# EAGLE design untitled (EAGLE 8.4.2)
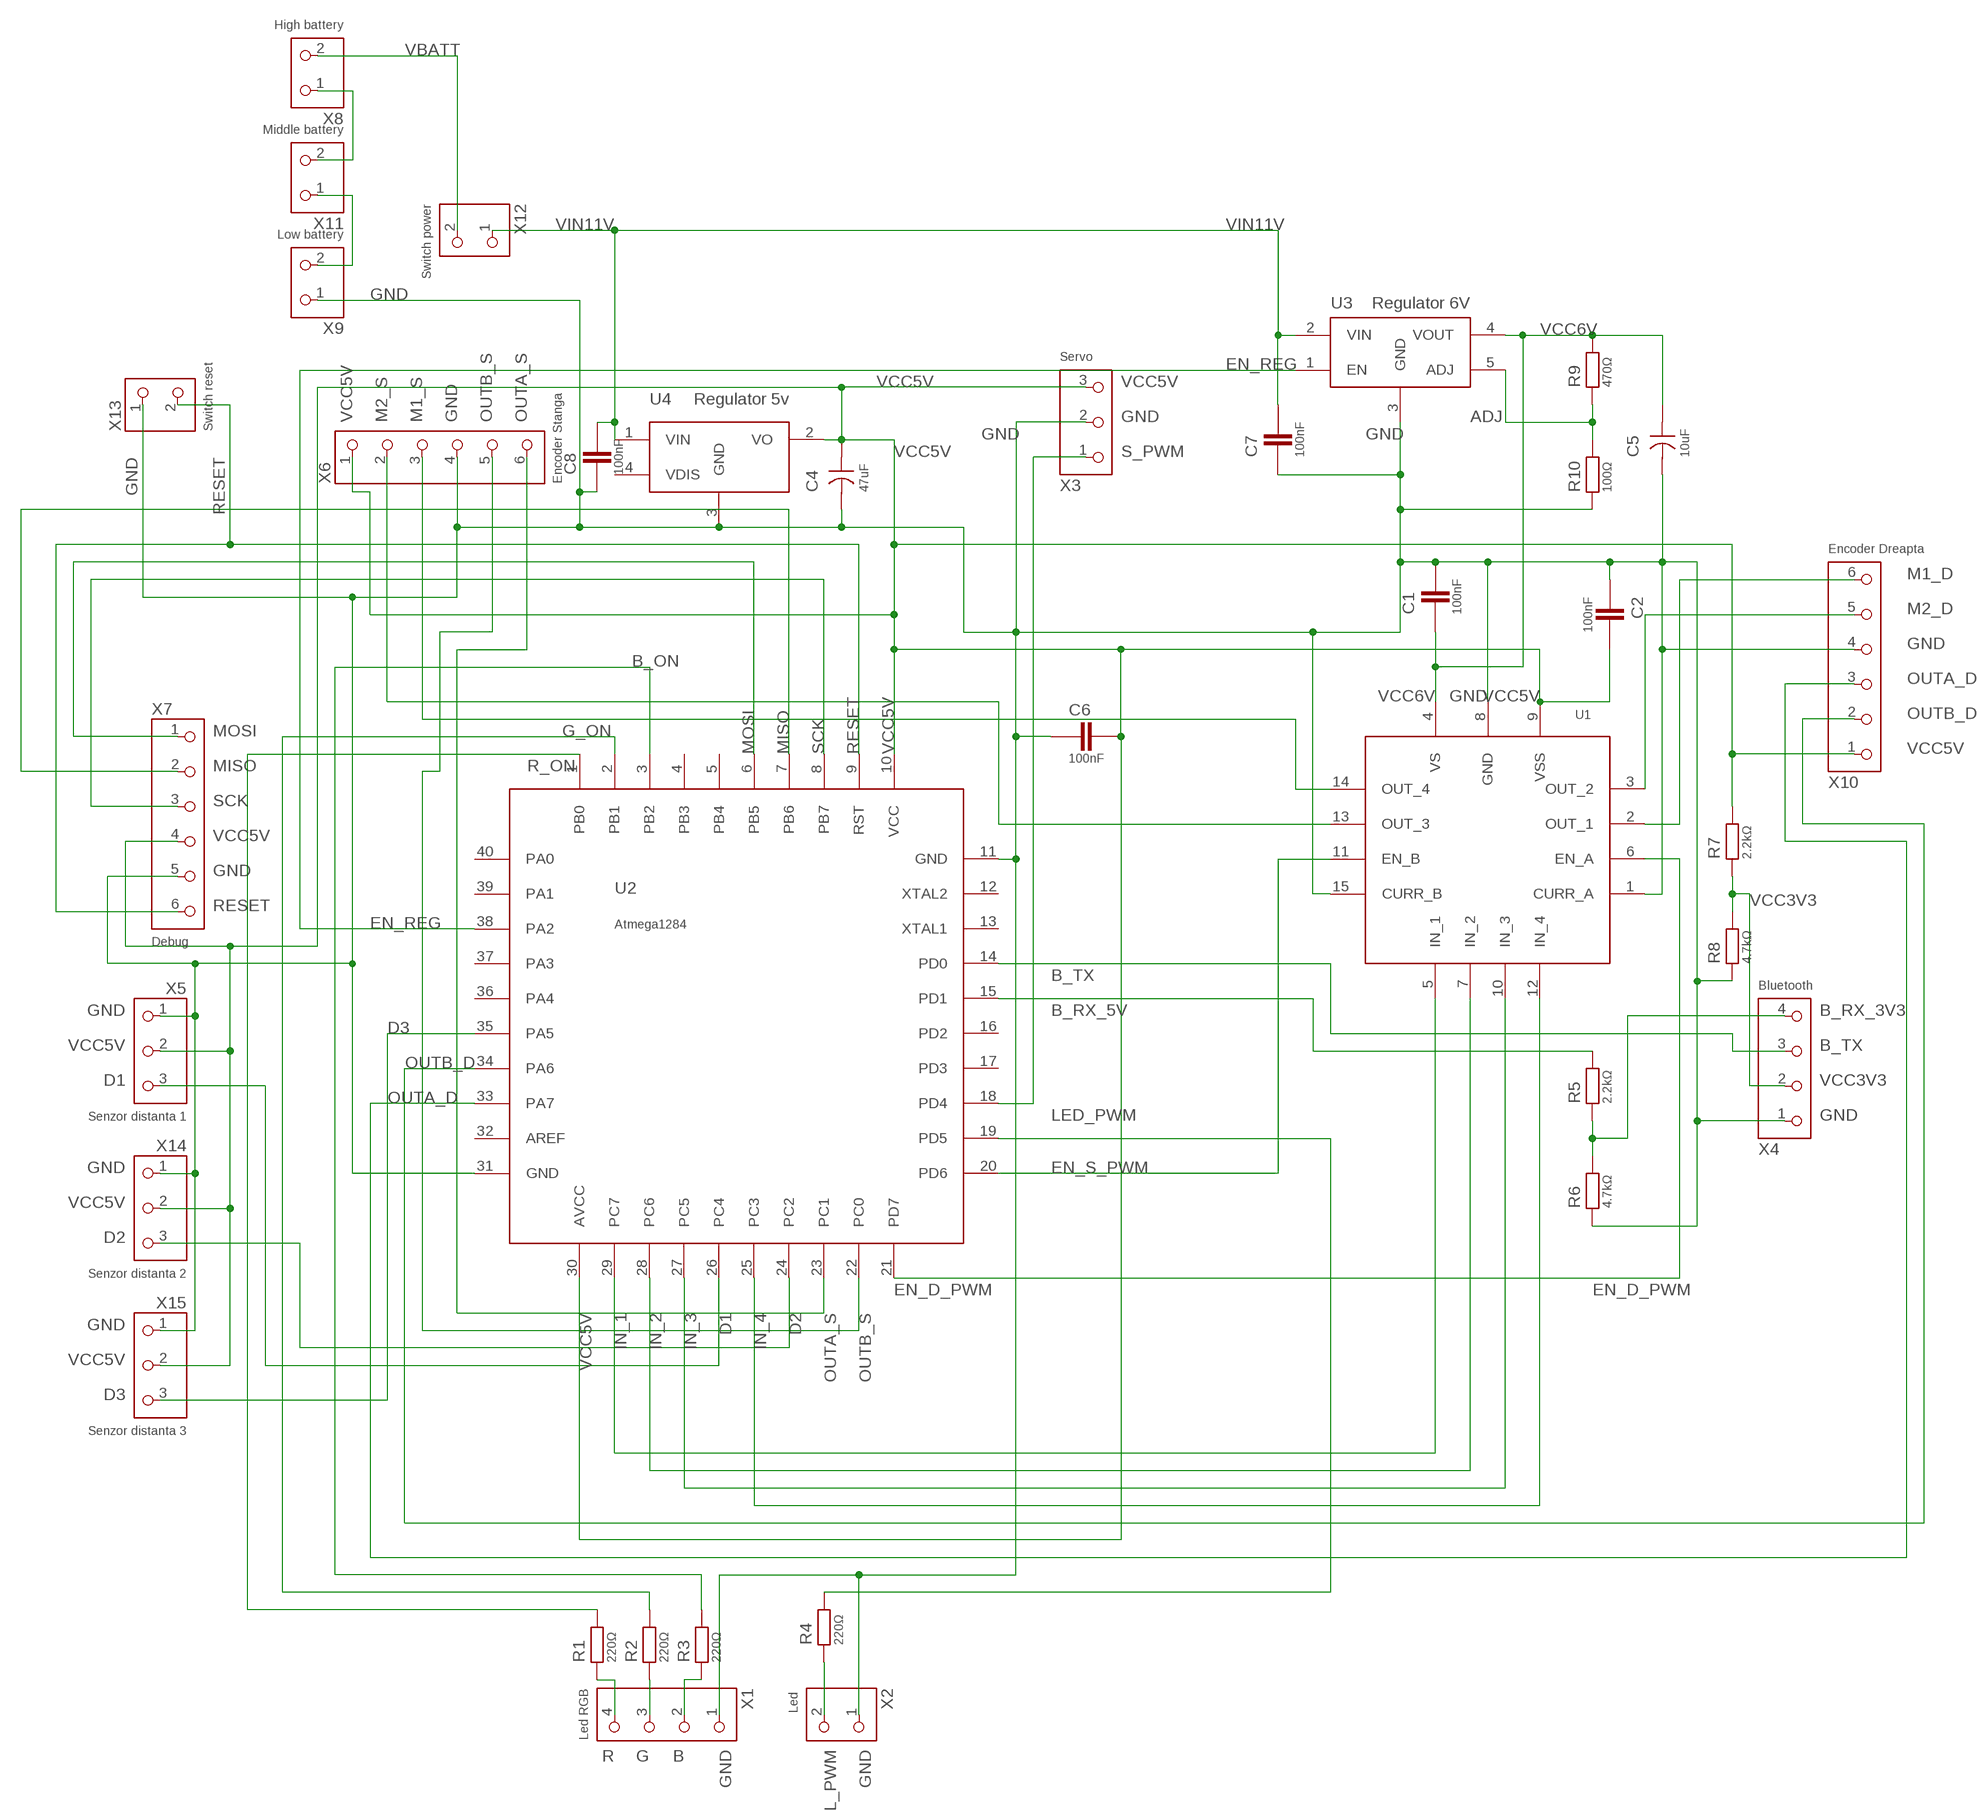
[diagram p0: schematic, sheet 1]

## Parts
C1  100nF  CAPACITORTHT_2.54  [THT_2.54]
C2  100nF  CAPACITORTHT_2.54  [THT_2.54]
C4  47uF  ELECTROLYTIC_CAPACITOR5MM_PERFBOARD  [ELECTROLYTIC_5MM_PEFRBOARD]
C5  10uF  ELECTROLYTIC_CAPACITOR5MM_PERFBOARD  [ELECTROLYTIC_5MM_PEFRBOARD]
C6  100nF  CAPACITORTHT_2.54  [THT_2.54]
C7  100nF  CAPACITORTHT_2.54  [THT_2.54]
C8  100nF  CAPACITORTHT_2.54  [THT_2.54]
R1  220Ω  RESISTORTHT_5.08  [THT_5.08]
R2  220Ω  RESISTORTHT_5.08  [THT_5.08]
R3  220Ω  RESISTORTHT_5.08  [THT_5.08]
R4  220Ω  RESISTORTHT_5.08  [THT_5.08]
R5  2.2kΩ  RESISTORTHT_2.54  [THT_2.54]
R6  4.7kΩ  RESISTORTHT_5.08  [THT_5.08]
R7  2.2kΩ  RESISTORTHT_5.08  [THT_5.08]
R8  4.7kΩ  RESISTORTHT_5.08  [THT_5.08]
R9  470Ω  RESISTORTHT_2.54  [THT_2.54]
R10  100Ω  RESISTORTHT_5.08  [THT_5.08]
U1  L298NMULTIWATT15V_PERFBOARD  [MULTIWATT15V_PERFBOARD]
U2  Atmega1284  ATMEGAPDIP  [DIP-40]
U3  Regulator 6V  MIC29XXPERFBOARD  [TO-220-5_PERFBOARD]
U4  Regulator 5v  KA78R05C  [TO-220-4]
X1  Led RGB  CONNECTOR_4PIN  [MALE_PIN_1X4]
X2  Led  CONNECTOR_2PINMALE_PIN  [MALE_PIN_1X2]
X3  Servo  CONNECTOR_3PIN  [MALE_PIN_1X3]
X4  Bluetooth  CONNECTOR_4PIN  [MALE_PIN_1X4]
X5  Senzor distanta 1  CONNECTOR_3PIN  [MALE_PIN_1X3]
X6  Encoder Stanga  CONNECTOR_6PIN2X3  [MALE_PIN_2X3]
X7  Debug  CONNECTOR_6PIN2X3  [MALE_PIN_2X3]
X8  High battery  CONNECTOR_2PINFEMALE_SCREW  [FEMALE_SCREW_1X2]
X9  Low battery  CONNECTOR_2PINFEMALE_SCREW  [FEMALE_SCREW_1X2]
X10  Encoder Dreapta  CONNECTOR_6PIN2X3  [MALE_PIN_2X3]
X11  Middle battery  CONNECTOR_2PINFEMALE_SCREW  [FEMALE_SCREW_1X2]
X12  Switch power  CONNECTOR_2PINMALE_PIN  [MALE_PIN_1X2]
X13  Switch reset  CONNECTOR_2PINMALE_PIN  [MALE_PIN_1X2]
X14  Senzor distanta 2  CONNECTOR_3PIN  [MALE_PIN_1X3]
X15  Senzor distanta 3  CONNECTOR_3PIN  [MALE_PIN_1X3]

## Nets
ADJ: R9.1 R10.2 U3.5(ADJ)
B: R3.1 X1.2
B_ON: R3.2 U2.3(PB2)
B_RX_3V3: R5.1 R6.2 X4.4
B_RX_5V: R5.2 U2.15(PD1)
B_TX: U2.14(PD0) X4.3
D1: U2.26(PC4) X5.3
D2: U2.24(PC2) X14.3
D3: U2.35(PA5) X15.3
EN_D_PWM: U1.6(EN_A) U2.21(PD7)
EN_REG: U2.38(PA2) U3.1(EN)
EN_S_PWM: U1.11(EN_B) U2.20(PD6)
G: R2.1 X1.3
G_ON: R2.2 U2.2(PB1)
GND: C1.2 C2.1 C4.- C5.- C6.1 C7.1 C8.1 R6.1 R8.1 R10.1 U1.1(CURR_A) U1.8(GND) U1.15(CURR_B) U2.11(GND) U2.31(GND) U3.3(GND) U4.3(GND) X1.1 X2.1 X3.2 X4.1 X5.1 X6.4 X7.5 X9.1 X10.4 X13.1 X14.1 X15.1
IN_1: U1.5(IN_1) U2.29(PC7)
IN_2: U1.7(IN_2) U2.28(PC6)
IN_3: U1.10(IN_3) U2.27(PC5)
IN_4: U1.12(IN_4) U2.25(PC3)
L_PWM: R4.1 X2.2
LED_PWM: R4.2 U2.19(PD5)
M1_D: U1.2(OUT_1) X10.6
M1_S: U1.14(OUT_4) X6.3
M2_D: U1.3(OUT_2) X10.5
M2_S: U1.13(OUT_3) X6.2
MISO: U2.7(PB6) X7.2
MOSI: U2.6(PB5) X7.1
N$2: X8.1 X11.2
N$43: X9.2 X11.1
OUTA_D: U2.33(PA7) X10.3
OUTA_S: U2.23(PC1) X6.6
OUTB_D: U2.34(PA6) X10.2
OUTB_S: U2.22(PC0) X6.5
R: R1.1 X1.4
R_ON: R1.2 U2.1(PB0)
RESET: U2.9(RST) X7.6 X13.2
S_PWM: U2.18(PD4) X3.1
SCK: U2.8(PB7) X7.3
VBATT: X8.2 X12.2
VCC3V3: R7.1 R8.2 X4.2
VCC5V: C2.2 C4.+ C6.2 R7.2 U1.9(VSS) U2.10(VCC) U2.30(AVCC) U4.2(VO) X3.3 X5.2 X6.1 X7.4 X10.1 X14.2 X15.2
VCC6V: C1.1 C5.+ R9.2 U1.4(VS) U3.4(VOUT)
VIN11V: C7.2 C8.2 U3.2(VIN) U4.1(VIN) X12.1
Unconnected: U2.4(PB3) U2.5(PB4) U2.12(XTAL2) U2.13(XTAL1) U2.16(PD2) U2.17(PD3) U2.32(AREF) U2.36(PA4) U2.37(PA3) U2.39(PA1) U2.40(PA0) U4.4(VDIS)

## Library data of the parts
C1 C2 C6-C8 = Passives:CAPACITOR: Unpolarized capacitor
C4 C5 = Passives:ELECTROLYTIC_CAPACITOR: Electrolytic Capacitor
R1-R10 = Passives:RESISTOR: Resistor
U1 = Motors:L298N
U2 = Microcontrollers:ATMEGA: ATmega1284 microcontroller Datasheet <https://drive.google.com/open?id=0Bx3EyoegSWevTDFya0JFOFlISGs> ATmega164A ATmega1284 Supply voltage 1.8 - 5.5 V 1.8 - 5.5 V Temp range -40℃ to 85℃ -40℃ to 85℃ Flash 16KB 128KB RAM 1KB 16KB EEPROM 512B 4KB GPIOs 32 32 SPI Yes Yes I²C Yes Yes USART 2 2 ADC 10bit 10bit Analog Comparator Yes Yes Timer 2x 8bit 1x16bit 2x 8bit 2x16bit PWM channels 6 8
U3 = Power Supplies:MIC29XX: MIC29XX High-Current Low Dropout Regulator
U4 = Power Supplies:KA78R05C
X1 X4 = Connectors:CONNECTOR_4PIN: 1x4 Male Pin Header
X2 X8 X9 X11-X13 = Connectors:CONNECTOR_2PIN: 1x2 Male Pin Header
X3 X5 X14 X15 = Connectors:CONNECTOR_3PIN: 1x3 Male Pin Header
X6 X7 X10 = Connectors:CONNECTOR_6PIN: 1x6 Male Pin Header

## Board
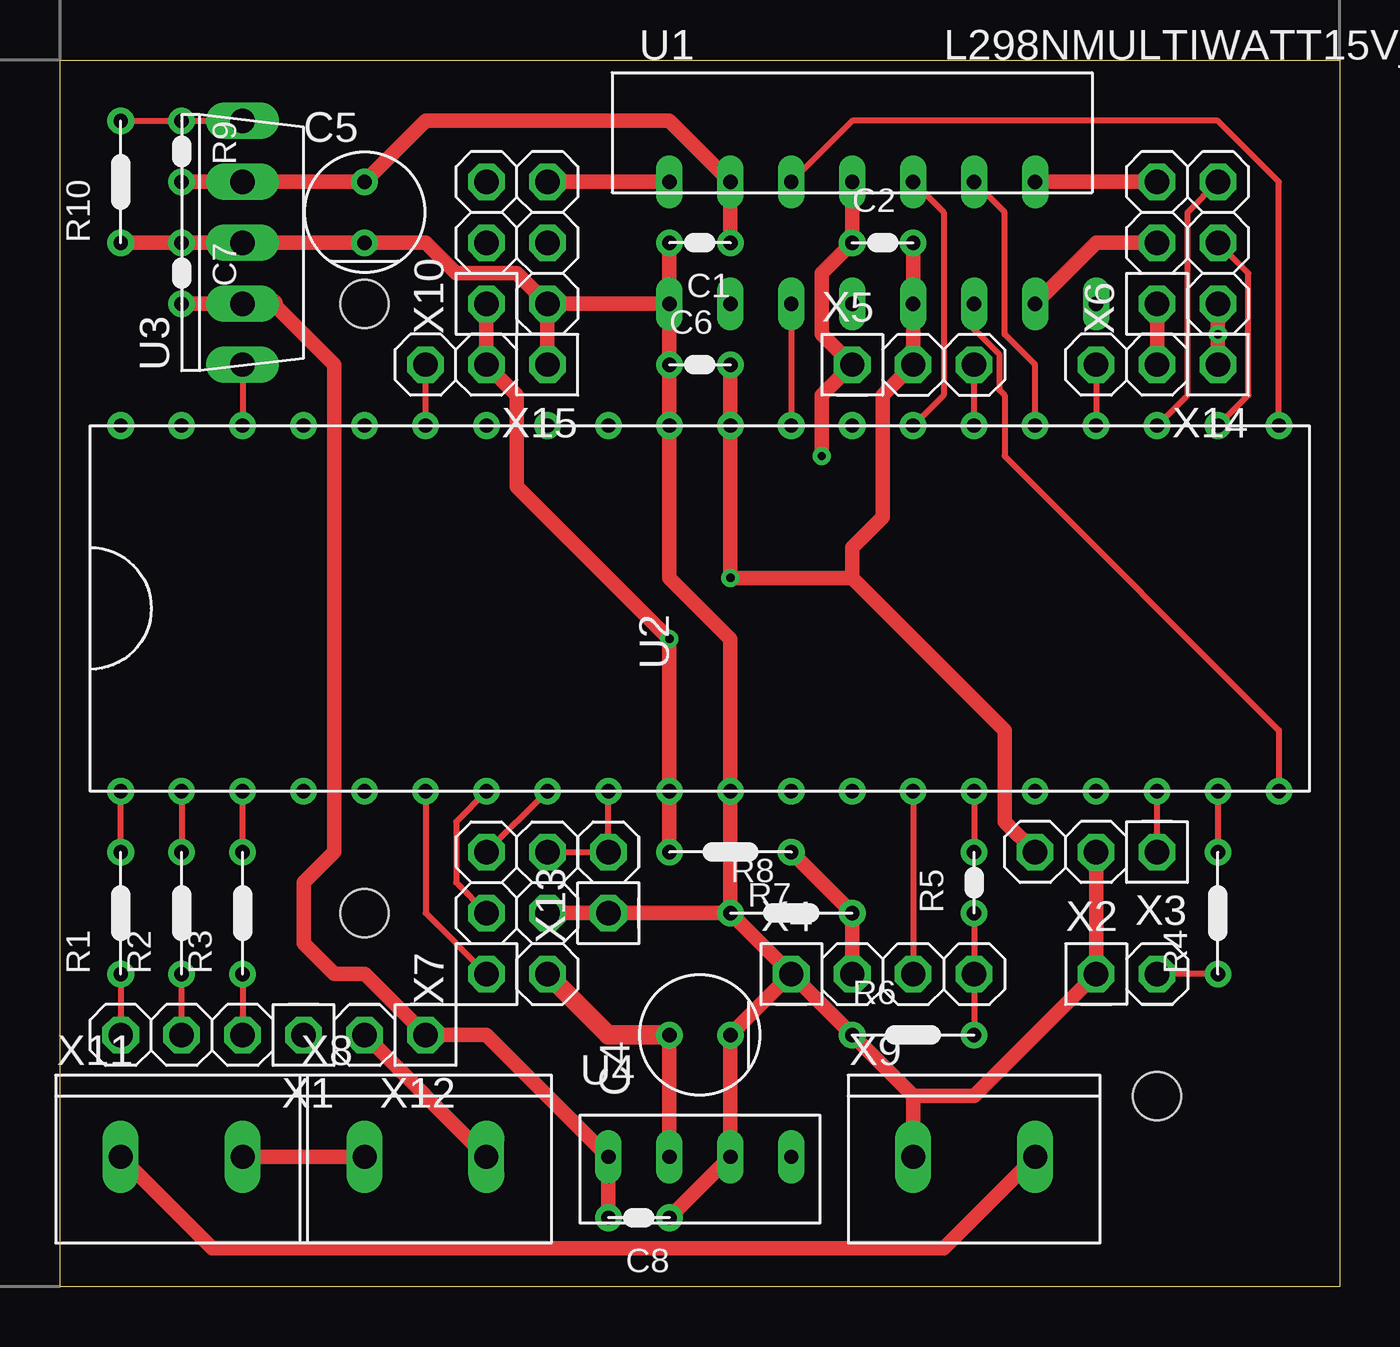
[diagram p1: board, top side]
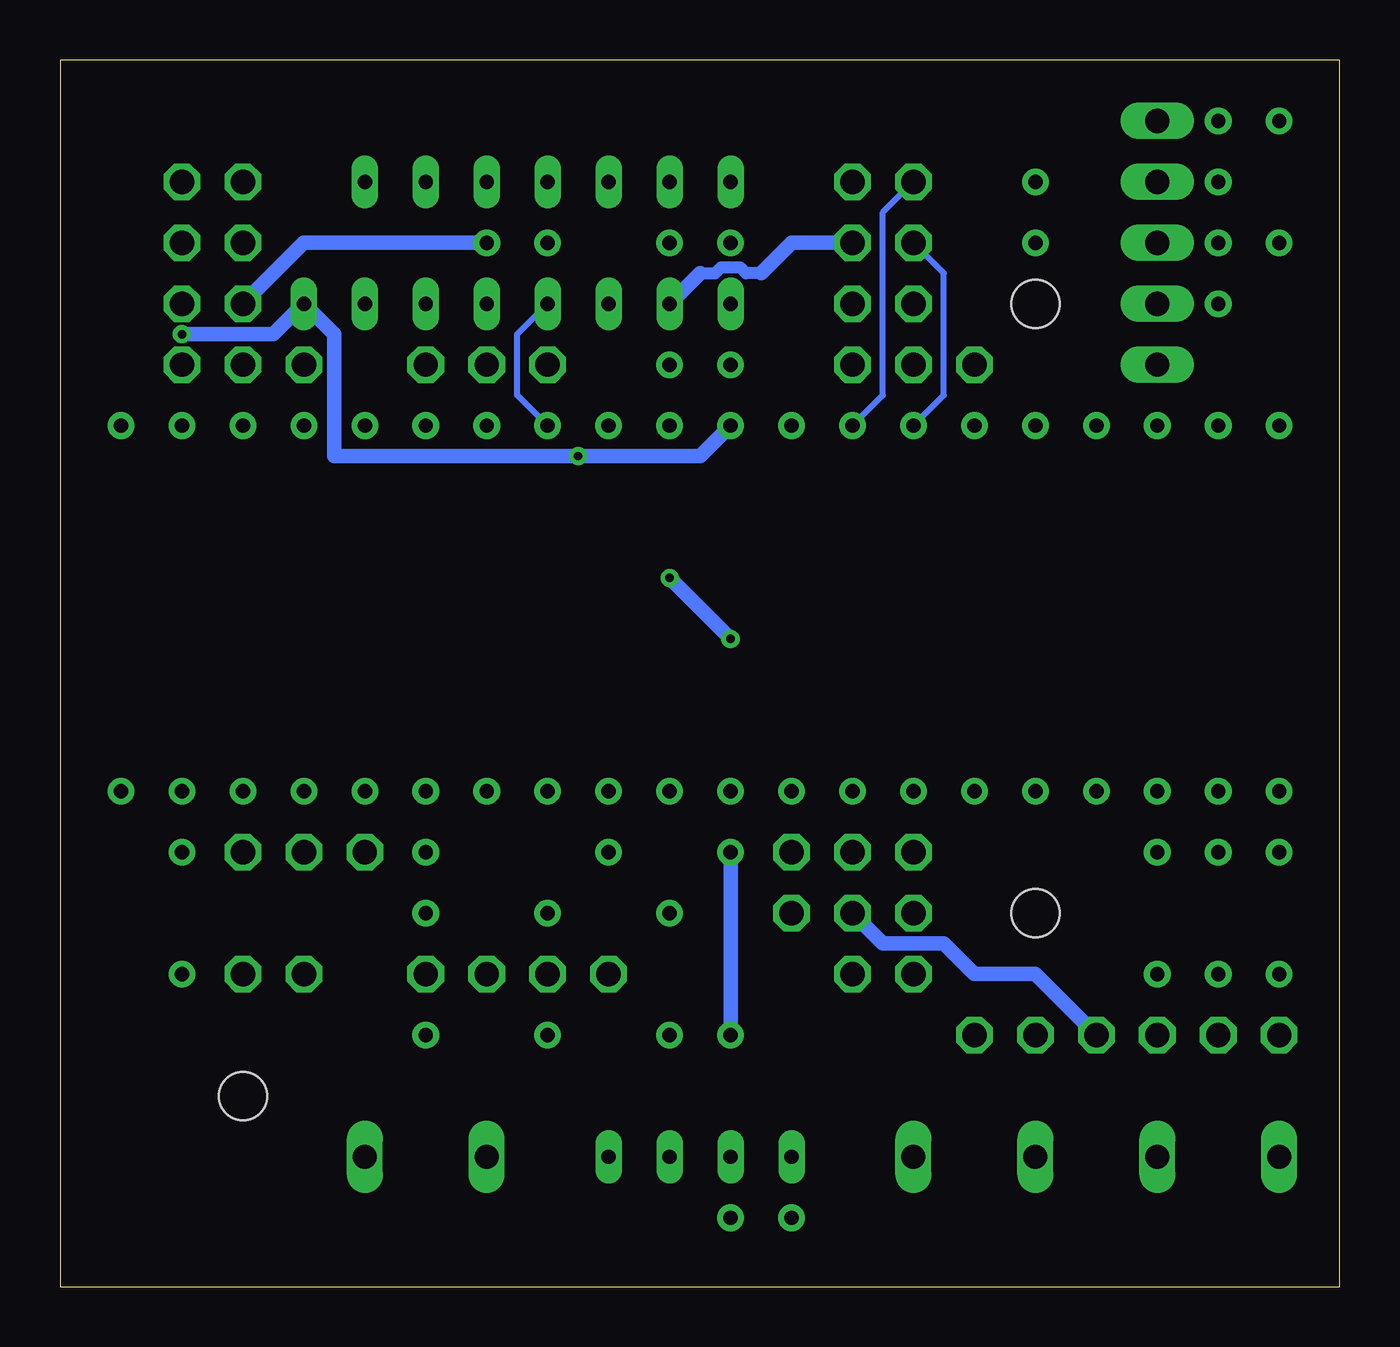
[diagram p2: board, bottom side, seen from below]

Size 53.33 x 51.13 mm. Coordinates in mm from the lower left corner, seen from the top.
Outline: 53.33,51.13 53.33,0 0,0 0,51.13 53.33,51.13
Copper layers (1*16): Top 0.035mm / dielectric 1.5mm / Bottom 0.035mm
Design rules "default": minimum track width 6mil, minimum drill 0.35mm, track to track 6mil, track to pad 6mil, pad to pad 6mil, via to via 6mil, smd to smd 6mil, copper to edge 40mil, drill to drill 6mil, minimum pad ring 10mil, minimum via ring 8mil, stop-mask expansion 4mil, vias tented up to drill 0mil, thermal gap 10mil
Holes 2 mm at 45.71,7.95 12.69,40.97 12.69,15.57

### Footprints (pad centres in the part's own frame; a part is rotated, then mirrored left to right if it is on the bottom)
THT_2.54 = drill 0.6: 1 -1.27,0; 2 1.27,0
ELECTROLYTIC_5MM_PEFRBOARD = drill 0.6: + 0,1.27; - 0,-1.27
THT_5.08 = drill 0.6: 1 -2.54,0; 2 2.54,0
MULTIWATT15V_PERFBOARD = drill 0.6 long: 1 -7.62,-2.54; 2 -7.62,2.54; 3 -5.08,-2.54; 4 -5.08,2.54; 5 -2.54,-2.54; 6 -2.54,2.54; 7 0,-2.54; 8 0,2.54; 9 2.54,-2.54; 10 2.54,2.54; 11 5.08,-2.54; 12 5.08,2.54; 13 7.62,-2.54; 14 7.62,2.54; 15 10.16,-2.54
DIP-40 = drill 0.6: 1 -7.62,24.13; 2 -7.62,21.59; 3 -7.62,19.05; 4 -7.62,16.51; 5 -7.62,13.97; 6 -7.62,11.43; 7 -7.62,8.89; 8 -7.62,6.35; 9 -7.62,3.81; 10 -7.62,1.27; 11 -7.62,-1.27; 12 -7.62,-3.81; 13 -7.62,-6.35; 14 -7.62,-8.89; 15 -7.62,-11.43; 16 -7.62,-13.97; 17 -7.62,-16.51; 18 -7.62,-19.05; 19 -7.62,-21.59; 20 -7.62,-24.13; 21 7.62,-24.13; 22 7.62,-21.59; 23 7.62,-19.05; 24 7.62,-16.51; 25 7.62,-13.97; 26 7.62,-11.43; 27 7.62,-8.89; 28 7.62,-6.35; 29 7.62,-3.81; 30 7.62,-1.27; 31 7.62,1.27; 32 7.62,3.81; 33 7.62,6.35; 34 7.62,8.89; 35 7.62,11.43; 36 7.62,13.97; 37 7.62,16.51; 38 7.62,19.05; 39 7.62,21.59; 40 7.62,24.13
TO-220-5_PERFBOARD = drill 1.016 long: 1 -5.08,0; 2 -2.54,0; 3 0,0; 4 2.54,0; 5 5.08,0
TO-220-4 = drill 0.6 long: 1 -3.81,0; 2 -1.27,0; 3 1.27,0; 4 3.81,0
MALE_PIN_1X4 = drill 1.016 octagon: 1 -3.81,0; 2 -1.27,0; 3 1.27,0; 4 3.81,0
MALE_PIN_1X2 = drill 1.016 octagon: 1 -1.27,0; 2 1.27,0
MALE_PIN_1X3 = drill 1.016 octagon: 1 -2.54,0; 2 0,0; 3 2.54,0
MALE_PIN_2X3 = drill 1.016 octagon: 1 -2.54,1.27; 2 0,1.27; 3 2.54,1.27; 4 -2.54,-1.27; 5 0,-1.27; 6 2.54,-1.27
FEMALE_SCREW_1X2 = drill 1 long: 1 -2.54,0; 2 2.54,0

### Placement (x,y rotation side)
C1  26.66,43.51 180 top
C2  34.28,43.51 0 top
C4  26.66,10.49 90 top
C5  12.69,44.78 0 top
C6  26.66,38.43 0 top
C7  5.07,42.24 270 top
C8  24.12,2.87 180 top
R1  2.53,15.57 90 top
R2  5.07,15.57 90 top
R3  7.61,15.57 90 top
R4  48.25,15.57 90 top
R5  38.09,16.84 90 top
R6  35.55,10.49 0 top
R7  27.93,18.11 180 top
R8  30.47,15.57 0 top
R9  5.07,47.32 270 top
R10  2.53,46.05 90 top
U1  33.01,43.51 0 top
U2  26.66,28.27 90 top
U3  7.61,43.51 90 top
U4  26.66,5.41 0 top
X1  6.34,10.49 180 top
X2  44.44,13.03 0 top
X3  43.17,18.11 180 top
X4  34.28,13.03 0 top
X5  35.55,38.43 0 top
X6  46.98,43.51 90 top
X7  19.04,15.57 90 top
X8  15.23,5.41 0 top
X9  38.09,5.41 0 top
X10  19.04,43.51 90 top
X11  5.07,5.41 0 top
X12  13.96,10.49 180 top
X13  22.85,16.84 90 top
X14  45.71,38.43 180 top
X15  17.77,38.43 180 top

### Tracks (layer width: path | path; a pad name or v marks a point on that pad's centre or on a via)
ADJ
  Top 0.254: R10.2 R9.1 U3.5
B
  Top 0.254: R3.1 X1.2
B_ON
  Top 0.254: R3.2 U2.3
B_RX_3V3
  Top 0.254: R5.1 X4.4 R6.2
B_RX_5V
  Top 0.254: U2.15 R5.2
B_TX
  Top 0.254: U2.14 X4.3
D1
  Top 0.254: U2.26 X5.3
D2
  Top 0.254: X14.3 U2.24
D3
  Top 0.254: U2.35 X15.3
EN_D_PWM
  Top 0.254: U2.21 50.79,46.05 48.25,48.59 33.01,48.59 U1.6
EN_REG
  Top 0.254: U3.1 U2.38
EN_S_PWM
  Top 0.254: U1.11 38.09,39.9 39.13,38.86 39.13,37.39 39.36,37.16 39.36,34.62 50.79,23.19 U2.20
G
  Top 0.254: X1.3 R2.1
G_ON
  Top 0.254: U2.2 R2.2
GND  (via drill 0.35)
  Top 0.61: 35.55,7.95 X9.1 | 35.55,7.95 R6.1 X4.1 | R8.1 X4.1 | X4.1 C4.- U4.3 C8.1 | R8.1 U2.11 27.93,27 25.39,29.54 U2.31 C6.1 C1.2 U1.1 X10.4 | R8.1 X13.1 X7.5 | X3.2 X2.1 38.09,7.95 35.55,7.95 | U1.8 C2.1 31.74,42.24 31.74,39.7 X5.1 31.74,37.16 v31.74,34.62 | X10.4 X15.1 | R10.1 C7.1 U3.3 C5.- 15.23,43.51 16.5,42.24 19.04,42.24 X10.4 | X6.4 v48.25,39.7 X14.1
  Bottom 0.61: X1.1 12.69,13.03 15.23,13.03 16.5,14.3 19.04,14.3 X7.5 | v48.25,39.7 44.44,39.7 U1.15 41.9,39.7 41.9,34.62 v31.74,34.62 26.66,34.62 U2.31
IN_1
  Top 0.254: U1.5 U2.29
IN_2
  Bottom 0.254: U2.28 34.28,37.16 34.28,39.7 U1.7
IN_3
  Top 0.254: U1.10 36.82,44.78 36.82,37.16 U2.27
IN_4
  Top 0.254: U2.25 40.63,38.43 39.36,39.7 39.36,44.78 U1.12
L_PWM
  Top 0.254: R4.1 X2.2
LED_PWM
  Top 0.254: U2.19 R4.2
M1_D
  Top 0.61: U1.2 X10.6
M1_S
  Top 0.61: X6.3 U1.14
M2_D
  Bottom 0.508: 26.66,42.24 26.03,42.24 25.79,42.48 24.99,42.48 24.75,42.24 24.12,42.24
  Bottom 0.61: U1.3 26.66,42.24 | X10.5 22.85,43.51 24.12,42.24
M2_S
  Top 0.61: X6.2 43.17,43.51 U1.13
MISO
  Top 0.254: U2.7 16.5,19.38 16.5,16.84 X7.2
MOSI
  Top 0.254: U2.6 15.23,15.57 X7.1
N$2
  Top 0.61: X8.1 X11.2
N$43
  Top 0.61: X9.2 36.82,1.6 6.34,1.6 X11.1
OUTA_D
  Bottom 0.254: U2.33 19.04,37.16 19.04,44.78 X10.3
OUTA_S
  Top 0.254: U2.23 46.98,37.16 46.98,44.78 X6.6
OUTB_D
  Bottom 0.254: U2.34 16.5,37.16 16.5,42.24 X10.2
OUTB_S
  Top 0.254: U2.22 49.52,37.16 49.52,42.24 X6.5
R
  Top 0.254: R1.1 X1.4
R_ON
  Top 0.254: R1.2 U2.1
RESET
  Top 0.254: X7.6 X13.2 U2.9
S_PWM
  Top 0.254: X3.1 U2.18
SCK
  Top 0.254: U2.8 X7.3
VBATT
  Top 0.61: X12.2 X8.2
VCC3V3
  Top 0.61: R7.1 R8.2 X4.2
VCC5V  (via drill 0.35)
  Top 0.61: R7.2 U2.10 v25.39,27 19.04,33.35 19.04,37.16 X15.2 X10.1 | C4.+ U4.2 | X3.3 39.36,19.38 39.36,23.19 33.01,29.54 | 33.01,29.54 v27.93,29.54 U2.30 C6.2 | C2.2 U1.9 X5.2 34.28,37.16 34.28,32.08 33.01,30.81 33.01,29.54 | X14.2 X6.1
  Top 0.813: X7.4 22.85,10.49 C4.+
  Bottom 0.61: v25.39,27 v27.93,29.54 | C2.2 43.17,43.51 X6.1 | R7.2 C4.+
VCC6V
  Top 0.61: R9.2 U3.4 C5.+ 15.23,48.59 25.39,48.59 U1.4 C1.1
VIN11V
  Top 0.61: C8.2 U4.1 17.77,10.49 X12.1 12.69,13.03 11.42,13.03 10.15,14.3 10.15,16.84 11.42,18.11 11.42,38.43 8.88,40.97 | C7.2 U3.2
  Top 0.813: U3.2 8.88,40.97

### Text on the board
tDocu: FATA | STANGA | DREAPTA | SPATE